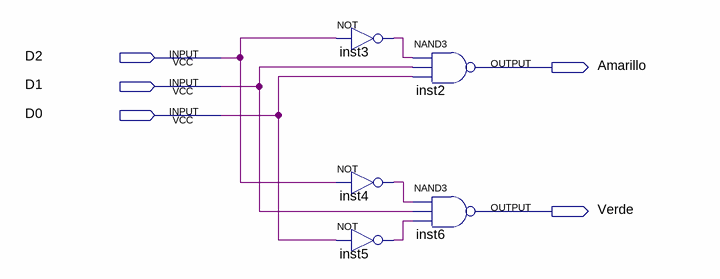
[diagram p0: schematic sheet]
// Quartus schematic Semaforo2.bdf as structural Verilog: 5 symbols, 5 pins
module Semaforo2 (
  input  D2,
  input  D1,
  input  D0,
  output Amarillo,
  output Verde
);

  wire inst3_out, inst4_out, inst5_out;

  not inst3 (inst3_out, D2);
  not inst4 (inst4_out, D2);
  not inst5 (inst5_out, D0);
  nand inst2 (Amarillo, inst3_out, D1, D0);
  nand inst6 (Verde, inst4_out, D1, inst5_out);
endmodule
